# Altium schematic sheet 01 Revisons.SchDoc
size A
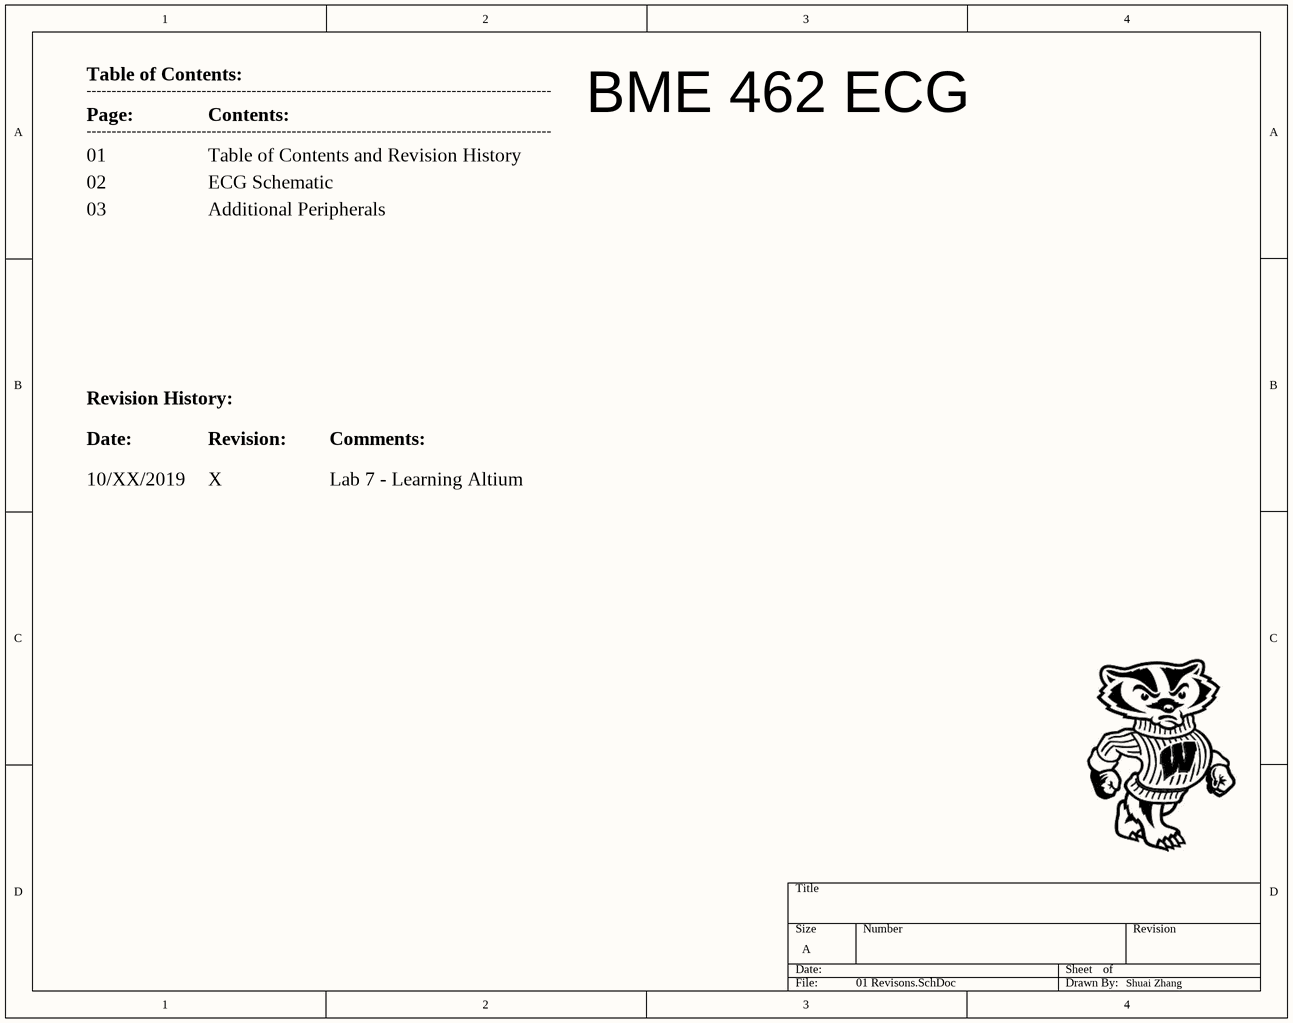
[diagram p0: 01 Revisons.SchDoc]

## Notes on the sheet
- Table of Contents:
- ---------------------------------------------------------------------------------------------
- Page:
- 01
- Contents:
- Table of Contents and Revision History
- BME 462 ECG
- 02
- 03
- ECG Schematic
- Additional Peripherals
- Revision History:
- Date:
- 10/XX/2019
- Revision:
- X
- Comments:
- Lab 7 - Learning Altium
- Shuai Zhang